# EAGLE design mainBoard (EAGLE 9.2.2)
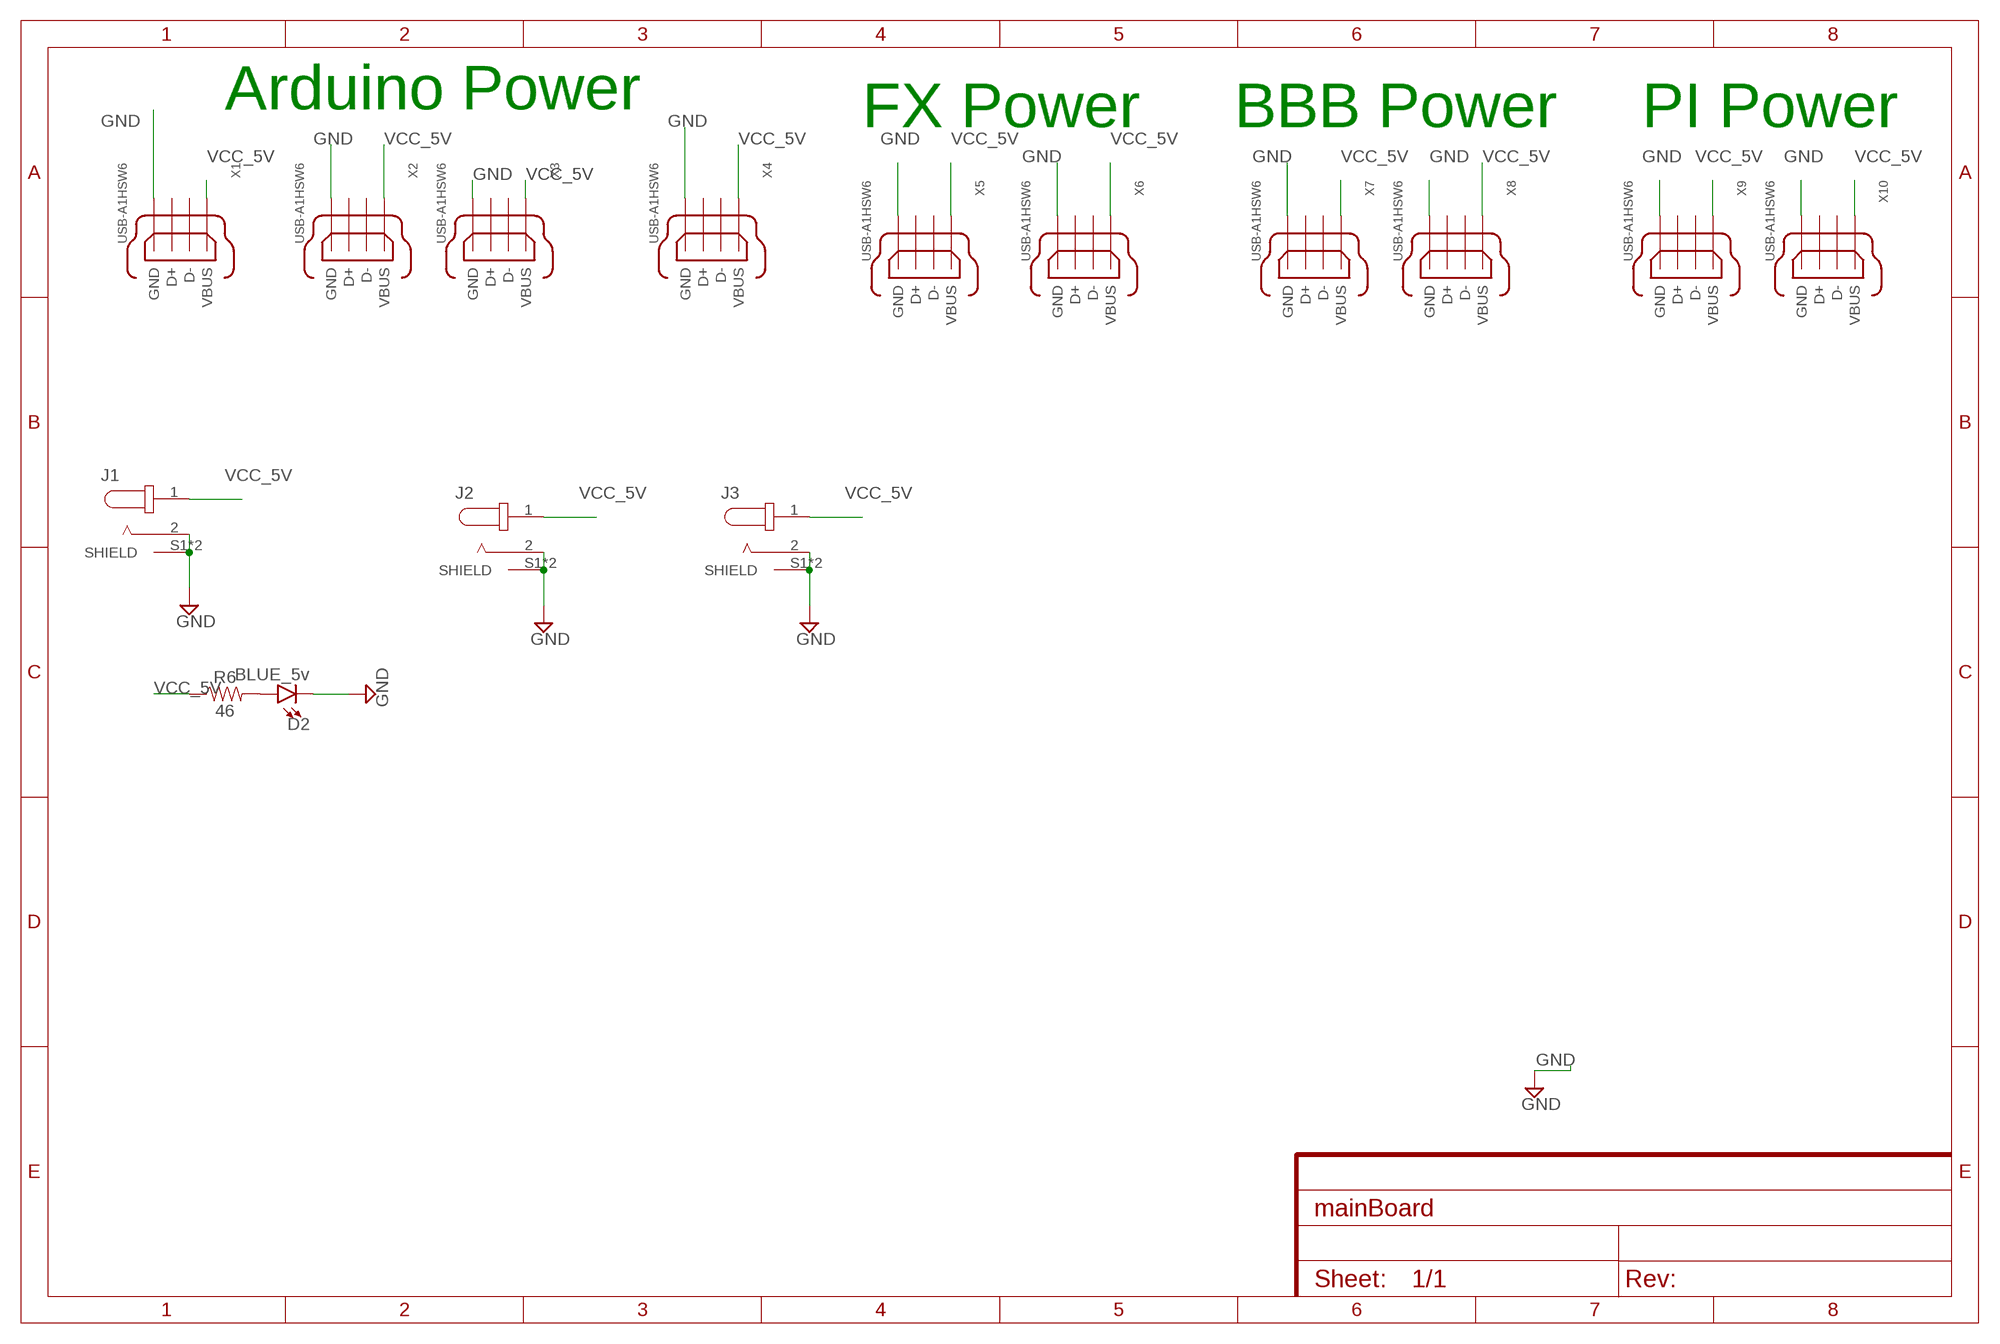
[diagram p0: schematic, sheet 1]

## Parts
D2  BLUE_5v  LED-BLUE0603  [LED-0603]
J1  PJ-063AH  [CUI_PJ-063AH]
J2  PJ-063AH  [CUI_PJ-063AH]
J3  PJ-063AH  [CUI_PJ-063AH]
R6  46  RESISTOR0603  [0603]
X1  USB-A1HSW6  [OST_USB-A1HSW6]
X2  USB-A1HSW6  [OST_USB-A1HSW6]
X3  USB-A1HSW6  [OST_USB-A1HSW6]
X4  USB-A1HSW6  [OST_USB-A1HSW6]
X5  USB-A1HSW6  [OST_USB-A1HSW6]
X6  USB-A1HSW6  [OST_USB-A1HSW6]
X7  USB-A1HSW6  [OST_USB-A1HSW6]
X8  USB-A1HSW6  [OST_USB-A1HSW6]
X9  USB-A1HSW6  [OST_USB-A1HSW6]
X10  USB-A1HSW6  [OST_USB-A1HSW6]

## Nets
GND: D2.C J1.2 J1.S1(SHIELD) J1.S2(SHIELD) J2.2 J2.S1(SHIELD) J2.S2(SHIELD) J3.2 J3.S1(SHIELD) J3.S2(SHIELD) X1.4(GND) X2.4(GND) X3.4(GND) X4.4(GND) X5.4(GND) X6.4(GND) X7.4(GND) X8.4(GND) X9.4(GND) X10.4(GND)
N$2: D2.A R6.2
VCC_5V: J1.1 J2.1 J3.1 R6.1 X1.1(VBUS) X2.1(VBUS) X3.1(VBUS) X4.1(VBUS) X5.1(VBUS) X6.1(VBUS) X7.1(VBUS) X8.1(VBUS) X9.1(VBUS) X10.1(VBUS)
Unconnected: X1.2(D-) X1.3(D+) X2.2(D-) X2.3(D+) X3.2(D-) X3.3(D+) X4.2(D-) X4.3(D+) X5.2(D-) X5.3(D+) X6.2(D-) X6.3(D+) X7.2(D-) X7.3(D+) X8.2(D-) X8.3(D+) X9.2(D-) X9.3(D+) X10.2(D-) X10.3(D+)

## Notes on the sheet
- Arduino Power | FX Power | BBB Power | PI Power

## Library data of the parts
D2 = SparkFun-LED:LED-BLUE: Blue SMD LED Used in manufacturing of various products at SparkFun Packages: 0603 - SMD 0603 package [Product Link] <http://www.digikey.com/product-detail/en/SMLE12BC7TT86/511-1589-2-ND/1641808> 1206 - SMD1206 package [Product Link] <http://www.digikey.com/product-detail/en/lite-on-inc/LTST-C150TBKT/160-1643-1-ND/573584> SparkFun Products: ESP8266 Thing-Dev Board <https://www.sparkfun.com/products/13711> RedBoard <https://www.sparkfun.com/products/12757>; PROD_ID: DIO-08575; VALUE: BLUE
J1-J3 = PJ-063AH:PJ-063AH: 2.0 mm Center Pin, 8.0 A, Right Angle, Through Hole, Shielded, Kinked Pins, Dc Power Jack Connector; AVAILABILITY: Unavailable; CUI_PURCHASE_URL: https://www.cui.com/product/interconnect/dc-power-connectors/jacks/2.0-mm-center-pin/pj-063ah?utm_source=snapeda.com&utm_medium=referral&utm_campaign=snapedaBOM; DESCRIPTION: 2.0 mm Center Pin, 8.0 A, Right Angle, Through Hole, Shielded, Kinked Pins, Dc Power Jack Connector; MF: CUI Inc.; MP: PJ-063AH; PACKAGE: None; PRICE: None
R6 = SparkFun-Resistors:RESISTOR: Generic Resistor Package
X1-X10 = USB-A1HSW6:USB-A1HSW6: USB - A Receptacle Connector 4 Position Through Hole, Right Angle; AVAILABILITY: Unavailable; DESCRIPTION: Conn Usb Type a r/a White; MF: On Shore; MP: USB-A1HSW6; PACKAGE: None; PRICE: None

## Board
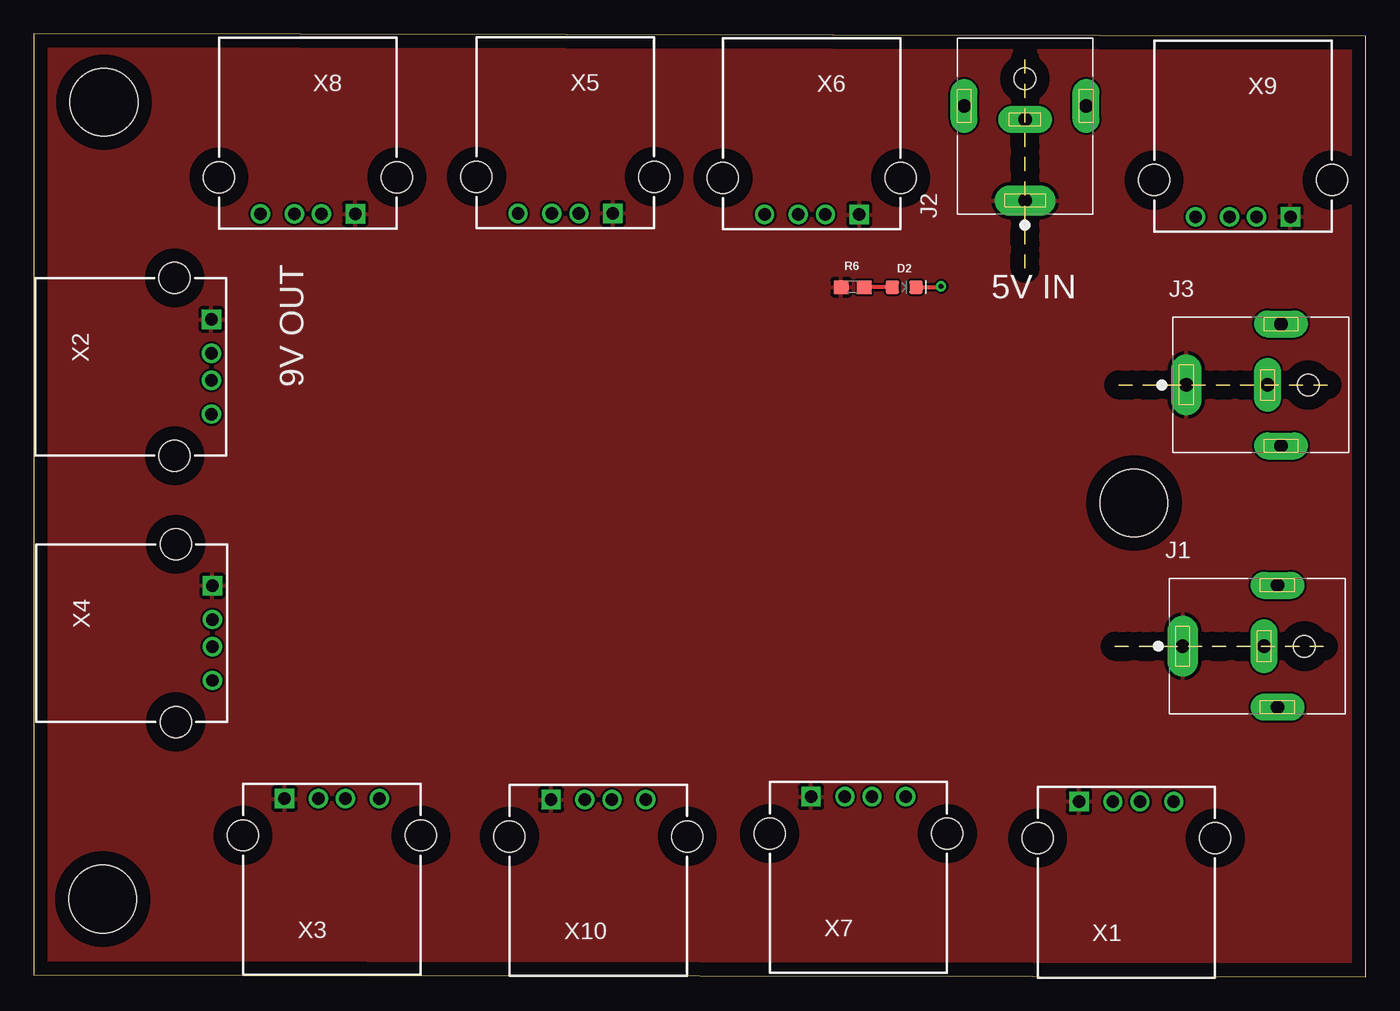
[diagram p1: board, top side]
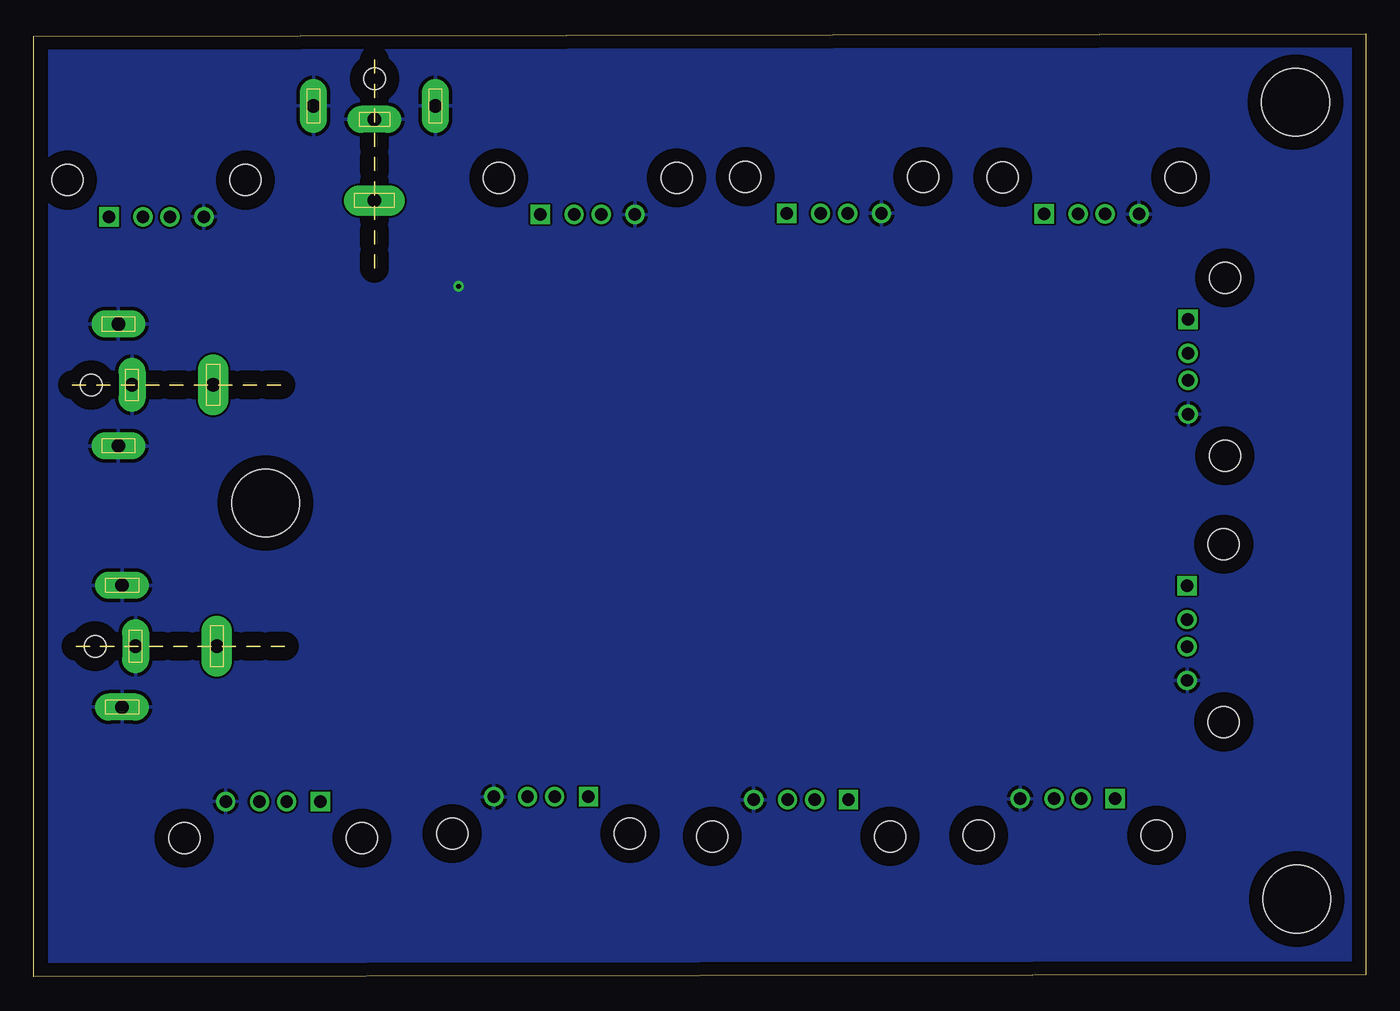
[diagram p2: board, bottom side, seen from below]

Size 98.4 x 69.68 mm. Coordinates in mm from the lower left corner, seen from the top.
Outline: 0,0.16 98.4,0 98.4,69.52 0,69.68 0,0.16
Copper layers (1*16): Top 0.035mm / dielectric 1.5mm / Bottom 0.035mm
Design rules "default": minimum track width 6mil, minimum drill 0.35mm, track to track 6mil, track to pad 6mil, pad to pad 6mil, via to via 6mil, smd to smd 6mil, copper to edge 40mil, drill to drill 6mil, minimum pad ring 10mil, minimum via ring 8mil, stop-mask expansion 4mil, vias tented up to drill 0mil, thermal gap 10mil
Holes 5 mm at 5.18,64.63 5.08,5.75 81.28,35.01

### Footprints (pad centres in the part's own frame; a part is rotated, then mirrored left to right if it is on the bottom)
LED-0603 = smd 1 x 1: A -0.877,0; C 0.877,0
CUI_PJ-063AH = drill 1 pad 2.25 long: 1 0,0 | drill 1 pad 2 long: 2 6,0; S1 7,4.5; S2 7,-4.5 | hole 1.6: 9,0
0603 = smd 1.1 x 1: 1 -0.85,0; 2 0.85,0
OST_USB-A1HSW6 = drill 0.92 square: 1 -3.5,6.51 | drill 0.92: 2 -1,6.51; 3 1,6.51; 4 3.5,6.51 | hole 2.3: -6.57,3.8; 6.57,3.8

### Placement (x,y rotation side)
D2  64.31,50.97 0 top
J1  84.88,24.43 0 top
J2  73.23,57.36 90 top
J3  85.15,43.74 0 top
R6  60.5,50.97 0 top
X1  80.72,6.45 0 top
X2  6.61,45.09 270 top
X3  22.02,6.66 0 top
X4  6.68,25.41 270 top
X5  39.28,62.93 180 top
X6  57.48,62.85 180 top
X7  60.92,6.8 0 top
X8  20.25,62.89 180 top
X9  89.34,62.68 180 top
X10  41.71,6.59 0 top

### Tracks (layer width: path | path; a pad name or v marks a point on that pad's centre or on a via)
GND  (via drill 0.35)
  Top 0.152: 66.96,50.97 v67.02,51.03
  Top 0.305: D2.C 66.96,50.97
  pour Bottom: 0.49,69.38 97.76,69.38 97.76,0.6 0.49,0.6
N$2
  Top 0.305: D2.A R6.2
VCC_5V
  pour Top: 97.69,69.48 97.69,0.76 0.59,0.76 0.59,69.48

### Text on the board
tNames: 9V OUT | 5V IN